# EAGLE design TX5823_ZMR250_V (EAGLE 7.7.0)
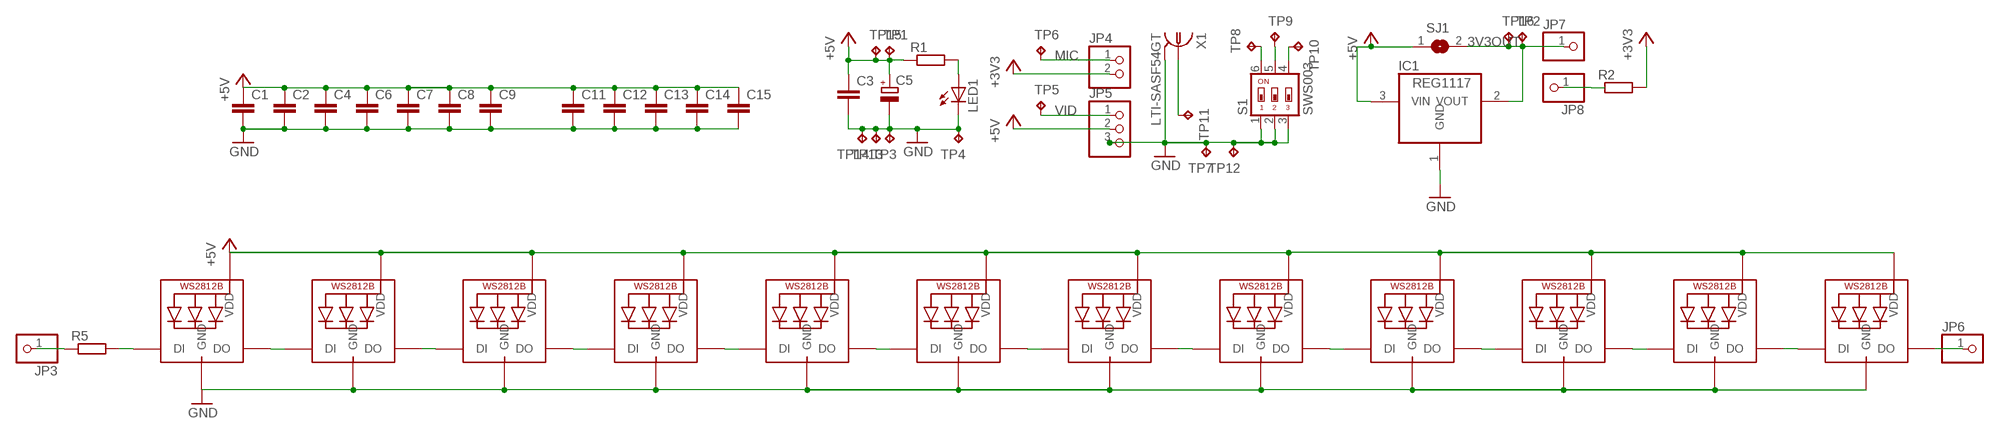
[diagram p0: schematic, sheet 1]

## Parts
C1  C-EUC0603  [C0603]
C2  C-EUC0603  [C0603]
C3  C-EUC0805  [C0805]
C4  C-EUC0603  [C0603]
C5  CPOL-EUSMCB  [SMC_B]
C6  C-EUC0603  [C0603]
C7  C-EUC0603  [C0603]
C8  C-EUC0603  [C0603]
C9  C-EUC0805  [C0805]
C11  C-EUC0603  [C0603]
C12  C-EUC0603  [C0603]
C13  C-EUC0805  [C0805]
C14  C-EUC0805  [C0805]
C15  C-EUC0805  [C0805]
IC1  REG1117  [SOT223]
JP3  PINHD-1X1  [1X01]
JP4  PINHD-1X2  [1X02]
JP5  PINHD-1X3  [1X03]
JP6  PINHD-1X1  [1X01]
JP7  PINHD-1X1  [1X01]
JP8  PINHD-1X1  [1X01]
LED1  LEDCHIPLED_0603  [CHIPLED_0603]
LED2  WS2812B5050  [WS2812B]
LED3  WS2812B5050  [WS2812B]
LED4  WS2812B5050  [WS2812B]
LED5  WS2812B5050  [WS2812B]
LED6  WS2812B5050  [WS2812B]
LED7  WS2812B5050  [WS2812B]
LED8  WS2812B5050  [WS2812B]
LED9  WS2812B5050  [WS2812B]
LED10  WS2812B5050  [WS2812B]
LED11  WS2812B5050  [WS2812B]
LED12  WS2812B5050  [WS2812B]
LED13  WS2812B5050  [WS2812B]
R1  R-EU_R0603  [R0603]
R2  R-EU_M1406  [M1406]
R5  R-EU_R0603  [R0603]
S1  SWS003  [SMS-003]
SJ1  SJ  [SJ]
TP1  TPB1,27  [B1,27]
TP2  TPB1,27  [B1,27]
TP3  TPB1,27  [B1,27]
TP4  TPB1,27  [B1,27]
TP5  TPB1,27  [B1,27]
TP6  TPB1,27  [B1,27]
TP7  TPB1,27  [B1,27]
TP8  TPB1,27  [B1,27]
TP9  TPB1,27  [B1,27]
TP10  TPB1,27  [B1,27]
TP11  TPB1,27  [B1,27]
TP12  TPB1,27  [B1,27]
TP13  TPB1,27  [B1,27]
TP14  TPB1,27  [B1,27]
TP15  TPB1,27  [B1,27]
TP16  TPB1,27  [B1,27]
X1  LTI-SASF54GT  [LTI-SASF54GT]

## Nets
3V3OUT: IC1.2(VOUT) JP7.1 SJ1.2 TP2.TP TP16.TP
+3V3: JP4.2 R2.2
+5V: C1.1 C2.1 C3.1 C4.1 C5.+ C6.1 C7.1 C8.1 C9.1 C11.1 C12.1 C13.1 C14.1 C15.1 IC1.3(VIN) JP5.2 LED2.1-VDD(VDD) LED3.1-VDD(VDD) LED4.1-VDD(VDD) LED5.1-VDD(VDD) LED6.1-VDD(VDD) LED7.1-VDD(VDD) LED8.1-VDD(VDD) LED9.1-VDD(VDD) LED10.1-VDD(VDD) LED11.1-VDD(VDD) LED12.1-VDD(VDD) LED13.1-VDD(VDD) R1.1 SJ1.1 TP1.TP TP15.TP
GND: C1.2 C2.2 C3.2 C4.2 C5.- C6.2 C7.2 C8.2 C9.2 C11.2 C12.2 C13.2 C14.2 C15.2 IC1.1(GND) JP5.3 LED1.C LED2.3-GND(GND) LED3.3-GND(GND) LED4.3-GND(GND) LED5.3-GND(GND) LED6.3-GND(GND) LED7.3-GND(GND) LED8.3-GND(GND) LED9.3-GND(GND) LED10.3-GND(GND) LED11.3-GND(GND) LED12.3-GND(GND) LED13.3-GND(GND) S1.1 S1.2 S1.3 TP3.TP TP4.TP TP7.TP TP12.TP TP13.TP TP14.TP X1.2 X1.3 X1.4 X1.5
IN: LED2.4-DIN(DI) R5.2
IO1: LED2.2-DOUT(DO) LED3.4-DIN(DI)
IO3: LED4.2-DOUT(DO) LED5.4-DIN(DI)
LED_IN: JP3.1 R5.1
MIC: JP4.1 TP6.TP
N$1: S1.6 TP8.TP
N$2: S1.5 TP9.TP
N$3: S1.4 TP10.TP
N$4: JP8.1 R2.1
N$5: LED5.2-DOUT(DO) LED6.4-DIN(DI)
N$6: TP11.TP X1.1
N$8: LED8.4-DIN(DI) LED10.2-DOUT(DO)
N$9: LED3.2-DOUT(DO) LED4.4-DIN(DI)
N$10: LED1.A R1.2
N$11: LED6.2-DOUT(DO) LED7.4-DIN(DI)
N$12: LED8.2-DOUT(DO) LED11.4-DIN(DI)
N$13: LED7.2-DOUT(DO) LED9.4-DIN(DI)
N$14: LED9.2-DOUT(DO) LED10.4-DIN(DI)
N$16: LED11.2-DOUT(DO) LED12.4-DIN(DI)
N$17: LED12.2-DOUT(DO) LED13.4-DIN(DI)
N$18: JP6.1 LED13.2-DOUT(DO)
VID: JP5.1 TP5.TP

## Library data of the parts
C1-C4 C6-C9 C11-C15 = rcl:C-EU: CAPACITOR, European symbol
C5 = rcl:CPOL-EU: POLARIZED CAPACITOR, European symbol
IC1 = burr-brown:REG1117: 800mA and 1A Low Dropout (LDO) Positive Regulator 1.8V, 2.5V, 2.85V, 3.3V, 5V, and Adj; MPN: REG1117; OC_FARNELL: 1097566; OC_NEWARK: 14P6981
JP3 JP6-JP8 = adafruit:PINHD-1X1: Pin header 1x1 for 0.1" spacing With round pins
JP4 = pinhead:PINHD-1X2: PIN HEADER
JP5 = pinhead:PINHD-1X3: PIN HEADER
LED1 = led:LED: LED OSRAM: - CHIPLED LG R971, LG N971, LY N971, LG Q971, LY Q971, LO R971, LY R971 LH N974, LH R974 LS Q976, LO Q976, LY Q976 LO Q996 - Hyper CHIPLED LW Q18S LB Q993, LB Q99A, LB R99A - SideLED LS A670, LO A670, LY A670, LG A670, LP A670 LB A673, LV A673, LT A673, LW A673 LH A674 LY A675 LS A676, LA A676, LO A676, LY A676, LW A676 LS A679, LY A679, LG A679 - Hyper Micro SIDELED® LS Y876, LA Y876, LO Y876, LY Y876 LT Y87S - SmartLED LW L88C, LW L88S LB L89C, LB L89S, LG L890 LS L89K, LO L89K, LY L89K LS L896, LA L896, LO L896, LY L896 - TOPLED LS T670, LO T670, LY T670, LG T670, LP T670 LSG T670, LSP T670, LSY T670, LOP T670, LYG T670 LG T671, LOG T671, LSG T671 LB T673, LV T673, LT T673, LW T673 LH T674 LS T676, LA T676, LO T676, LY T676, LB T676, LH T676, LSB T676, LW T676 LB T67C, LV T67C, LT T67C, LS T67K, LO T67K, LY T67K, LW E67C LS E67B, LA E67B, LO E67B, LY E67B, LB E67C, LV E67C, LT E67C LW T67C LS T679, LY T679, LG T679 LS T770, LO T770, LY T770, LG T770, LP T770 LB T773, LV T773, LT T773, LW T773 LH T774 LS E675, LA E675, LY E675, LS T675 LS T776, LA T776, LO T776, LY T776, LB T776 LHGB T686 LT T68C, LB T68C - Hyper Mini TOPLED® LB M676 - Mini TOPLED Santana® LG M470 LS M47K, LO M47K, LY M47K Source: http://www.osram.convergy.de LUXEON: - LUMILED® LXK2-PW12-R00, LXK2-PW12-S00, LXK2-PW14-U00, LXK2-PW14-V00 LXK2-PM12-R00, LXK2-PM12-S00, LXK2-PM14-U00 LXK2-PE12-Q00, LXK2-PE12-R00, LXK2-PE12-S00, LXK2-PE14-T00, LXK2-PE14-U00 LXK2-PB12-K00, LXK2-PB12-L00, LXK2-PB12-M00, LXK2-PB14-N00, LXK2-PB14-P00, LXK2-PB14-Q00 LXK2-PR12-L00, LXK2-PR12-M00, LXK2-PR14-Q00, LXK2-PR14-R00 LXK2-PD12-Q00, LXK2-PD12-R00, LXK2-PD12-S00 LXK2-PH12-R00, LXK2-PH12-S00 LXK2-PL12-P00, LXK2-PL12-Q00, LXK2-PL12-R00 Source: www.luxeon.com KINGBRIGHT: KA-3528ASYC Source: www.kingbright.com
LED2-LED13 = adafruit:WS2812B
R1 R5 = resistor:R-EU_: RESISTOR, European symbol
R2 = rcl:R-EU_: RESISTOR, European symbol
S1 = smd-special:SWS003: SMD Dip Switch 3 pol.
SJ1 = jumper:SJ: SMD solder JUMPER
TP1-TP16 = testpad:TP: Test pad
X1 = con-coax:LTI-SASF54GT: SMA vertical PCB thrue hole jack Source: Lighthorse Technologies, inc. SASF54GT.pdf; OC_FARNELL: unknown; OC_NEWARK: unknown

## Board
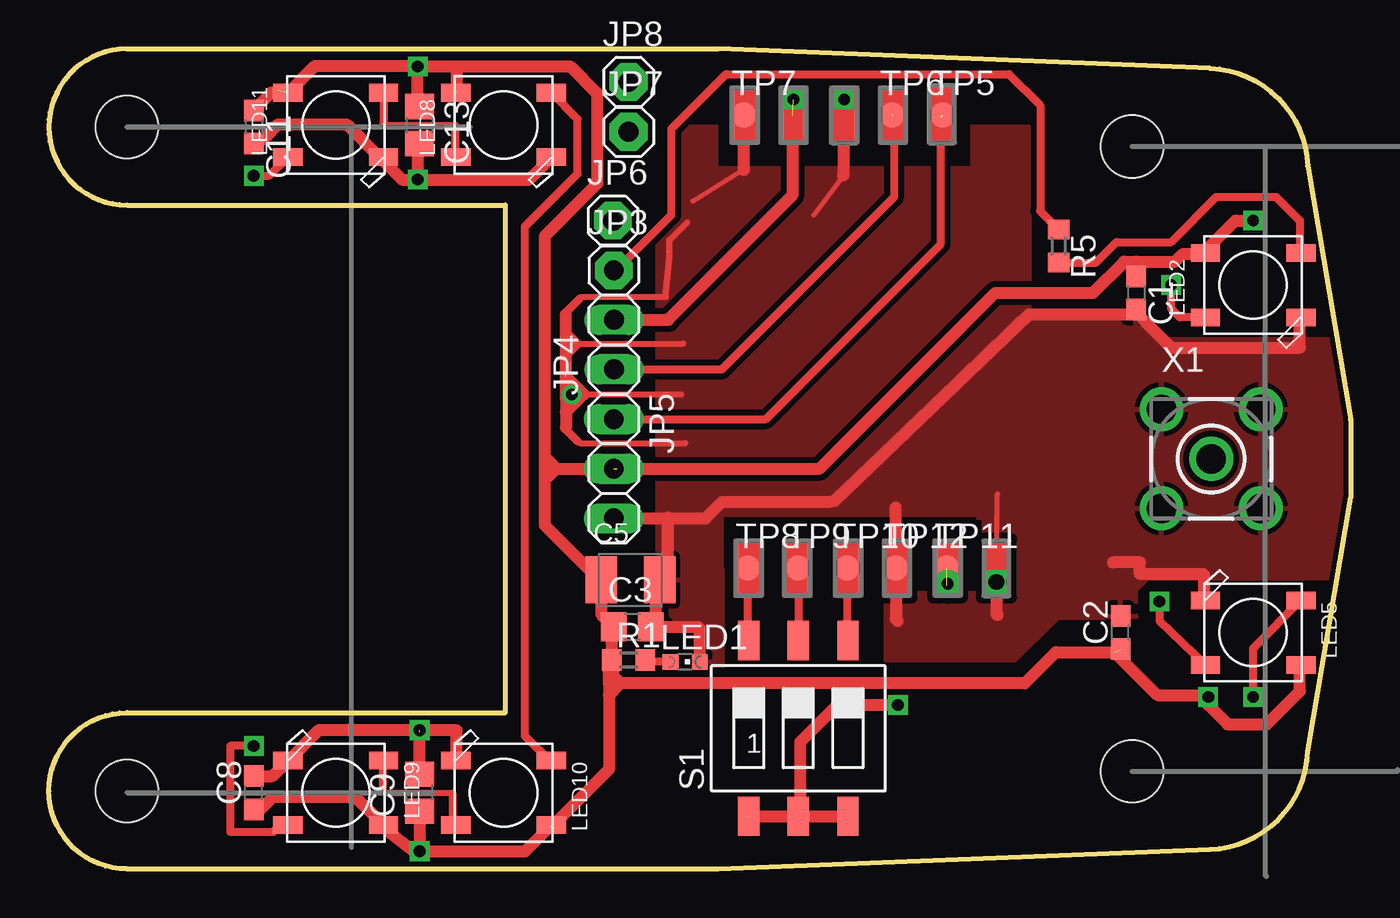
[diagram p1: board, top side]
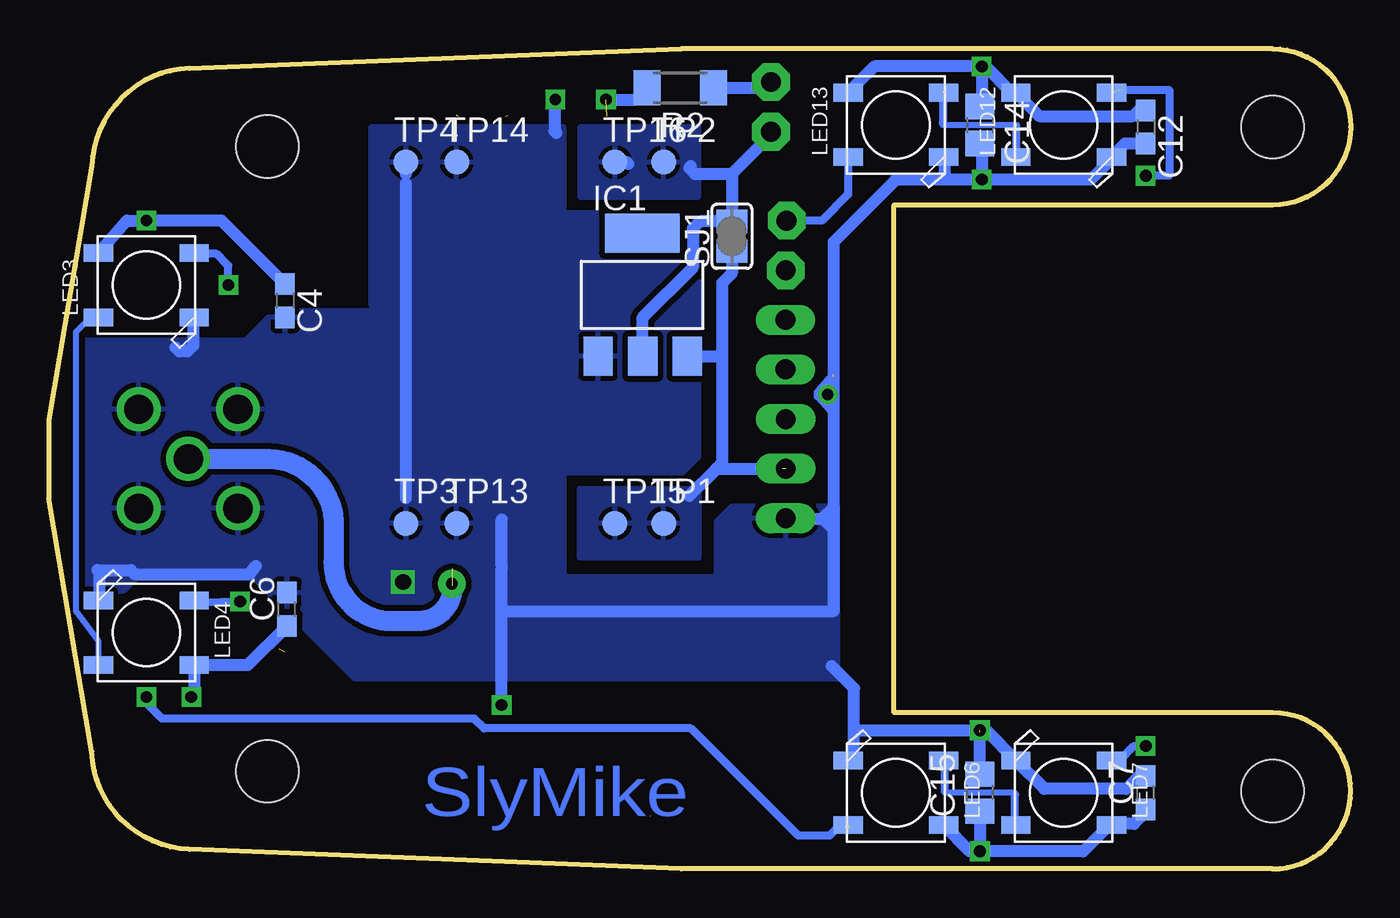
[diagram p2: board, bottom side, seen from below]

Size 66.7 x 42 mm. Coordinates in mm from the lower left corner, seen from the top.
Outline: 4,0 34.3,0 59.5,1 arc85 64.5,6 66.7,19 66.7,23 64.5,36 arc85 59.5,41 34.3,42 4,42 arc90 0,38 arc90 4,34 23.4,34 23.4,8 4,8 arc90 0,4 arc90 4,0
Copper layers (1*16): Top 0.035mm / dielectric 1.5mm / Bottom 0.035mm
Design rules "default *": minimum track width 10mil, minimum drill 24mil, track to track 12mil, track to pad 12mil, pad to pad 12mil, via to via 12mil, smd to smd 12mil, copper to edge 10mil, drill to drill 12mil, minimum pad ring 10mil, minimum via ring 8mil, stop-mask expansion 4mil, vias tented up to drill 0mil, thermal gap 10mil
Holes 3.2 mm at 4,38 4,4 55.5,37 55.5,5
tRestrict: area 34.3,36 to 47.2,38.6; area 34.6,15.4 to 47.5,18

### Footprints (pad centres in the part's own frame; a part is rotated, then mirrored left to right if it is on the bottom)
C0603 = smd 1.1 x 1: 1 -0.85,0; 2 0.85,0
C0805 = smd 1.3 x 1.5: 1 -0.95,0; 2 0.95,0
SMC_B = smd 1.6 x 2.4: + -1.5,0; - 1.5,0
SOT223 = smd 1.499 x 2.007: 1 -2.261,-3.15; 2 0.025,-3.15; 3 2.311,-3.15 | smd 3.81 x 2.007: 4 0,3.15
1X01 = drill 1.016 pad 1.93 octagon: 1 0,0
1X02 = drill 1.016 long: 1 -1.27,0; 2 1.27,0
1X03 = drill 1.016 long: 1 -2.54,0; 2 0,0; 3 2.54,0
CHIPLED_0603 = smd 0.8 x 0.8: A 0,-0.75; C 0,0.75
WS2812B = smd 1.5 x 0.9: 1-VDD 2.45,-1.65; 2-DOUT 2.45,1.65; 3-GND -2.45,1.65; 4-DIN -2.45,-1.65
R0603 = smd 1 x 1.1: 1 -0.85,0; 2 0.85,0
M1406 = smd 1.4 x 1.8: 1 -1.7,0; 2 1.7,0
SMS-003 = smd 1.092 x 2.007: 1 -2.54,-4.496; 2 0,-4.496; 3 2.54,-4.496; 4 2.54,4.496; 5 0,4.496; 6 -2.54,4.496
SJ = smd 1.168 x 1.6: 1 -0.762,0; 2 0.762,0
B1,27 = smd 1.27 x 1.27: TP 0,0
LTI-SASF54GT = drill 1.5 pad 2.2: 1 0,0; 2 -2.54,2.54; 3 2.54,2.54; 4 2.54,-2.54; 5 -2.54,-2.54

### Placement (x,y rotation side)
C1  55.7,29.5 270 top
C2  54.9,12.1 90 top
C3  29.9,12.4 0 top
C4  54.6,29.1 270 bottom
C5  29.8,14.8 0 top
C6  54.5,13.3 90 bottom
C7  10.5,3.9 90 bottom
C8  10.5,3.9 90 top
C9  19,3.9 90 top
C11  10.5,38 270 top
C12  10.5,38 270 bottom
C13  19,38.1 270 top
C14  19,38.1 270 bottom
C15  19,3.9 90 bottom
IC1  36.3,29.4 0 bottom
JP3  28.94,30.65 0 top
JP4  28.95,26.85 90 top
JP5  28.94,20.49 270 top
JP6  28.9,33.2 0 top
JP7  29.7,37.75 0 top
JP8  29.7,40.3 0 top
LED1  32.6,10.6 270 top
LED2  61.7,29.9 180 top
LED3  61.7,29.9 180 bottom
LED4  61.7,12.1 0 bottom
LED5  61.7,12.1 0 top
LED6  23.3,3.9 0 bottom
LED7  14.7,3.9 0 bottom
LED8  23.3,38.1 180 top
LED9  14.7,3.9 0 top
LED10  23.3,3.9 0 top
LED11  14.7,38.1 180 top
LED12  14.7,38.1 180 bottom
LED13  23.3,38.1 180 bottom
R1  29.7,10.7 0 top
R2  34.35,40 180 bottom
R5  51.73,31.9 270 top
S1  38.4,7.2 0 top
SJ1  31.7,32.4 90 bottom
TP1  35.2,17.7 0 bottom
TP2  35.2,36.2 0 bottom
TP3  48.4,17.7 0 bottom
TP4  48.4,36.2 0 bottom
TP5  45.8,38.6 0 top
TP6  43.2,38.6 0 top
TP7  35.6,38.6 0 top
TP8  35.8,15.4 0 top
TP9  38.4,15.4 0 top
TP10  40.9,15.4 0 top
TP11  46,15.4 0 top
TP12  43.4,15.4 0 top
TP13  45.8,17.7 0 bottom
TP14  45.8,36.2 0 bottom
TP15  37.7,17.7 0 bottom
TP16  37.7,36.2 0 bottom
X1  59.55,21 0 top

### Tracks (layer width: path | path; a pad name or v marks a point on that pad's centre or on a via)
3V3OUT
  Bottom 0.61: 35.25,36.45 35.15,36.05 | 33.8,36 33.9,35.9 33.6,35.6 31.7,35.6 | 31.6,33.26 SJ1.2 | 37.6,36.2 37.1,36.2 37,36.1 | SJ1.2 33.34,33.16 33.7,32.8 33.7,30.8 36.3,28.2 36.3,26.28 IC1.2 | 31.7,35.6 SJ1.2 | JP7.1 29.7,37.6 31.7,35.6
  pour Bottom: 33.4,38 39.5,38 39.5,34.4 33.4,34.4
+3V3  (via drill 0.6)  (1 unrouted)
  Top 0.61: 38.1,38.54 38.1,34.5 31.72,28.12 JP4.2
  Bottom 0.61: 36.35,39.7 R2.2 36.65,39.4 v38.15,39.4
+5V  (via drill 0.6)  (8 unrouted)
  Top 0.406: LED8.1-VDD 20.65,39.75
  Top 0.61: 55.7,31.1 55.1,31.1 53.5,29.5 48.5,29.5 39.49,20.49 JP5.2 27.69,20.49 | 55.7,31.1 57.7,31.1 58.1,31.5 59.2,31.5 LED2.1-VDD 59.3,31.5 59.3,31.7 60.8,33.2 v61.7,33.2 | 59.2,8.9 v59.4,8.8 59.4,8.4 60.4,7.4 62.4,7.4 64.1,9.1 64.1,10.4 LED5.1-VDD 64.3,10.3 64.1,10.3 | 59.2,8.9 56.8,8.9 54.6,11.1 51.6,11.1 50,9.5 29.3,9.5 | 59.2,8.9 59.25,8.95 | 29.3,9.5 28.7,9.5 | C1.1 55.7,31.1 | v19,0.9 18.7,0.9 16.95,2.25 LED9.1-VDD 15.7,3.7 11.5,3.7 10.85,3.05 C7.1 | v19,0.9 24.4,0.9 LED10.1-VDD 25.8,2.3 | 18.9,41.1 13.6,41.1 LED11.1-VDD 11.4,39.75 C11.1 | LED8.1-VDD 20.55,39.75 | 18.95,39.1 C14.1 | 18.95,39.1 19.3,39.1 | 18.9,41.1 20.7,41.1 | 20.7,41.1 20.9,40.9 20.9,39.8 20.8,39.7 | 18.95,39.1 18.9,39.1 18.9,41.1 | C15.1 v19,0.9 | 28.7,9.5 28.7,8.9 | 28.7,8.9 28.7,5.1 25.7,2.1 | 28.7,9.5 28.7,10.1 | 28.7,10.1 28.7,10.75 R1.1 28.85,12.3 C3.1 28.3,13.05 C5.+ 27.8,15.3 27.7,15.3 25.4,17.6 25.4,19.9 | 20.7,41.1 26.7,41.1 28.1,39.7 28.1,35.1 25.4,32.4 25.4,21.1 | 25.4,21.1 25.4,20.5 | 25.4,20.5 25.9,20.5 | 25.9,20.5 26,20.5 | 26,20.5 29.1,20.5 | 25.4,20.5 25.4,19.9 | 28.7,8.9 29.3,9.5 | 29.3,9.5 28.9,9.9 | 28.9,9.9 28.7,10.1 | 28.7,10.1 28.9,10.3 28.9,9.9 | 25.9,20.5 25.9,20.6 | 25.9,20.6 25.4,21.1 | 25.9,20.6 26,20.5 | 26,20.5 25.4,19.9
  Bottom 0.406: LED7.1-VDD 12.35,2.25
  Bottom 0.61: LED4.1-VDD 59.25,8.95 v59.4,8.8 | 64.1,31.5 LED3.1-VDD 62.7,33.2 v61.7,33.2 57.85,33.2 C4.1 | 59.2,10.5 LED4.1-VDD | 12.35,2.25 13.7,0.9 v19,0.9 | v19,0.9 19.5,0.9 LED6.1-VDD 21.25,2.25 | C7.1 10.5,2.9 11.1,2.3 12.2,2.3 LED7.1-VDD | 18.9,41.1 18.7,41.1 17.35,39.75 LED12.1-VDD 15.95,38.55 11.15,38.55 10.8,38.9 10.55,38.9 C11.1 10.5,38.9 | 18.9,41.1 24.4,41.1 LED13.1-VDD | 18.9,41.1 18.9,39.1 | 33.9,19.1 32.5,20.5 | 32.5,20.5 29.51,20.5 29.5,20.49 JP5.2 | 19,3.1 v19,0.9 | 31.7,31.6 32,31.6 32.2,31.4 | 32.5,20.5 32.2,20.8 32.2,26.4 | SJ1.1 31.7,30.5 32.2,30 32.2,26.4 | IC1.3 32.25,26.25 32.2,26.3 32.25,26.45 32.2,26.4 | LED4.1-VDD 56.5,10.45 C6.1
  pour Bottom: 33.4,15.9 39.5,15.9 39.5,19.5 33.4,19.5
GND  (via drill 0.6, 0.8)  (7 unrouted)
  Top 0.254: 40.7,35.5 39.2,33.5 | 35.6,35.8 33,34.2 | v48.55,14.7 48.6,19.2
  Top 0.305: v26.8,24.3 26.9,24.3 | 27.4,24.3 32.4,24.3 | 27.1,21.9 27.2,21.8 32.6,21.8 | 27.2,29.2 27.3,29.3 31.6,29.3 31.8,31.3 31.8,32.2 32.7,33.1 | 26.5,26.8 26.6,26.9 27.2,26.9 | 27.2,26.9 32.5,26.9 | 27.2,26.9 26.7,26.4 26.7,27.4 27.2,26.9
  Top 0.406: 35.9,2.7 S1.2 S1.3 38.7,2.7 38.5,2.9 | 26.5,22.6 26.5,22.5 27.1,21.9 | 26.5,28.4 26.5,28.5 27.2,29.2
  Top 0.61: 35.7,2.9 35.9,2.7 | 56.1,28.1 57.5,26.7 64.1,26.7 64.1,28.2 LED2.3-GND | 59.1,13.7 arc90 59.2,13.8 59.2,15 arc90 59.1,15.1 55.9,15.1 55.9,15.7 54.52,15.7 | 18.9,7.1 13.8,7.1 LED9.3-GND | 20.45,5.55 LED10.3-GND | LED10.3-GND 20.9,5.5 | LED10.3-GND 20.8,5.5 | LED10.3-GND 20.9,5.6 20.9,7.1 v19,7.1 | 16.95,36.45 18.1,35.3 v18.9,35.3 | v18.9,35.3 24.6,35.3 LED8.3-GND 25.65,36.45 | C14.2 19,37 18.9,36.9 v18.9,35.3 | LED11.3-GND 16.95,36.45 | 16.95,36.45 15.3,38.1 11.7,38.1 11.1,37.5 10.75,37.2 C11.2 | C15.2 v19,7.1 | v19,7.1 18.9,7 18.9,7.1 | 18.9,7.1 v19,7.1 | LED1.C 33.35,12.3 33.25,12.4 C3.2 31,12.4 31.1,12.5 31.1,14.6 C5.- 31.7,15.1 31.7,18 | JP5.3 33.65,17.95 34.5,18.8 40,18.8 40.25,18.85 50.2,28.4 55.85,28.4 C1.2 | 38.5,2.9 38.5,6.5 40.4,8.4 v43.5,8.4 | 35.9,2.5 35.9,2.7 | 35.9,2.7 40.9,2.7 | 40.7,38.7 40.7,35.5 | TP7.TP 35.6,35.8 | 12.2,5.5 11.45,4.75 C7.2 | v26.8,24.3 26.5,24.1 26.5,23.4 | 26.5,23.4 26.5,22.6 | 26.7,24.2 26.8,24.2 26.9,24.3 27.4,24.3 | 26.5,24.2 26.5,25.2 | 26.5,25.2 26.5,26.8 26.5,28.4 | 43.5,12.7 43.4,12.8 TP12.TP 43.4,18.5 | 27.4,24.3 26.5,25.2 | 27.4,24.3 26.5,23.4 | v48.55,14.7 48.55,13.05 48.6,13
  Bottom 0.406: 25.7,5.5 LED6.3-GND 25.45,5.55 | 26.4,23.2 27.3,24.2 27.3,24.4 26.5,25.3 26.6,25.3
  Bottom 0.61: LED4.3-GND 63.75,13.65 64.1,13.7 64.1,15.2 64.2,15.3 62.5,15.3 62.3,15.1 56.4,15.1 56.1,15.5 | LED3.3-GND 59.3,28.3 59.3,26.8 59.6,26.5 60,26.5 60.2,26.7 | C7.2 10.85,4.75 11.5,4.1 15.7,4.1 LED7.3-GND 18.7,7.1 v19,7.1 25.4,7.1 25.45,7.05 | v18.9,35.3 13.3,35.3 12.15,36.45 LED12.3-GND 11.55,37.15 C11.2 | v18.9,35.3 20.6,35.3 20.8,35.5 20.8,36.3 20.7,36.4 LED13.3-GND | 18.9,37.3 v18.9,35.3 | 26.5,17.9 27,17.9 | 48.5,17.9 48.7,17.9 | 43.5,15.5 43.5,17.9 | v18.9,35.3 23.3,35.3 26.5,32.1 26.5,25.3 26.5,18.5 | 26.5,18.5 26.5,17.9 | 26.5,17.9 26.5,17.4 | 26.5,17.4 26.5,13.2 43.5,13.2 | 43.6,8.2 v43.5,8.4 43.5,13.2 | 43.5,13.2 43.5,15.4 | 26.5,17.4 27,17.9 | 27,17.9 27,18 26.5,18.5 | 27,17.9 28.89,17.9 JP5.3 | TP4.TP 48.4,35.6 | 48.4,19 48.4,35.1 | 19,5 19,7 | v40.75,39.4 40.8,39.5 40.8,37.8 40.7,37.7 | 25.45,5.55 25.45,7.05 | 25.45,7.05 25.45,9.25 26.6,10.4
  pour Top: 42.9,10.7 49.5,10.7 51.7,12.9 55.7,12.9 55.7,14.3 56.3,14.9 56.3,17.7 49.3,17.7 arc90 48.1,16.5 48.3,14.1 43.5,14.1 42.9,14.7
  pour Top: 31.3,38 50.2,38 50.2,27.6 50.2,18 34.5,18 34.5,10.4 33.3,10.4 33.3,12.4 33.4,12.5 32.4,12.5 31.1,13.8 31.1,15.9 31.2,16 31.2,37.9
  pour Top: 46.6,28.4 46.6,18 47.9,18 47.9,16.7 50.2,16.7 50.2,14.9 67.4,14.9 67.6,27.1 57.2,27.1 55.9,28.4
  pour Bottom: 40.3,15.9 40.3,20.3 34.2,20.3 33.4,21.1 33.4,33.6 40.3,33.6 40.3,38 50.2,38 50.2,28.9 49.5,28.2 49.5,15.9
  pour Bottom: 40.3,15.9 40.3,15 32.5,15 32.5,17.8 31.7,18.6 26.3,18.6 26.3,9.7 51,9.7 56.2,14.9 62.2,14.9 62.9,14.2 67.3,14.2 67.3,26.9 67.5,27.1 56.6,27.1 55.1,28.6 47.8,28.6 47.7,15.9
IN
  Top 0.406: R5.2 53.65,31.05 54.7,32.1 57.5,32.1 59.8,34.4 62.9,34.4 64.1,33.2 64.1,31.6 LED2.4-DIN
IO1  (via drill 0.6)
  Top 0.406: LED2.2-DOUT 57.95,28.25 57.5,28.7 v57.5,29.9
  Bottom 0.406: v57.5,29.9 57.5,30.9 58.1,31.5 59.2,31.5 LED3.4-DIN
IO3  (via drill 0.6)
  Top 0.406: 59.7,10.5 59.4,10.5 LED5.4-DIN 56.9,12.7 v56.9,13.7
  Bottom 0.406: LED4.2-DOUT 58.95,13.65 v56.9,13.7
LED_IN
  Top 0.406: JP3.1 29.2,30.65 29.2,30.8 31.9,33.5 31.9,37.9 34.7,40.7 49.2,40.7 50.8,39.1 50.8,33.68 R5.1
MIC  (1 unrouted)
  Top 0.406: 43.3,38.54 43.3,34.4 34.48,25.58 JP4.1
N$1
  Top 0.406: S1.6 arc90 S1.6 35.8,11.76 TP8.TP
N$2
  Top 0.406: S1.5 arc90 S1.5 TP9.TP
N$3
  Top 0.406: S1.4 arc90 S1.4 40.9,11.74 TP10.TP
N$4
  Bottom 0.61: R2.1 30,40 JP8.1
N$5  (via drill 0.6)  (1 unrouted)
  Top 0.406: 63.75,13.95 LED5.2-DOUT 61.7,11.3 v61.7,8.8
  Bottom 0.406: LED6.4-DIN 25.55,2.15 | 25.9,2.1 26.3,2.1 26.7,1.7 28.3,1.7 33.8,7.2 44.4,7.2 44.9,7.7 60.9,7.7 61.6,8.4 v61.7,8.8
N$6  (1 unrouted)
  Bottom 1.016: X1.1 55.7,21 arc90 52.1,17.8 52.1,16 arc-90 49.4,12.7 47.7,12.7 arc-90 46,14.5
N$8
  Top 0.406: LED8.4-DIN 27.1,38.4 27.1,35.6 24.4,32.9 24.4,6.8 25.75,5.45 LED10.2-DOUT
N$9
  Bottom 0.305: LED4.4-DIN 64.15,11.65 65.3,13.2 65.3,27.5 64.7,28.1 64.3,28.1 LED3.2-DOUT
N$10
  Top 0.406: LED1.A 30.45,10.6 R1.2
N$11
  Bottom 0.3: 17.2,3.8 17.3,3.9 20.8,3.9 20.8,4
  Bottom 0.406: 20.45,5.55 LED6.2-DOUT 20.8,5.3 20.8,4 | LED7.4-DIN 17.25,2.25 | 17.55,2.25 17.25,2.25 | 17.25,2.25 17.2,2.3 17.2,3.8
N$12  (1 unrouted)
  Top 0.3: 17.1,38.1 18.1,38.1 20.8,38.1
  Top 0.305: 20.8,38.1 20.85,38.05
  Top 0.406: LED11.4-DIN 17.55,39.75 17.3,39.7 17.15,39.55 17.15,38.15 | LED8.2-DOUT 20.85,38.05
N$13  (via drill 0.6)
  Top 0.406: 10.3,6.2 v10.5,6.3 9.3,6.3 9.3,1.9 11.5,1.9 11.9,2.3 12.2,2.3 LED9.4-DIN
  Bottom 0.406: LED7.2-DOUT 11.85,5.55 11.1,6.3 v10.5,6.3
N$14
  Top 0.3: 17.1,4 17.1,3.9 20.7,3.9 20.7,3.8
  Top 0.406: LED9.2-DOUT 17.35,5.55 | 17.55,5.55 17.35,5.55 | 17.35,5.55 17.1,5.3 17.1,4 | 20.7,3.8 20.7,2.4 LED10.4-DIN
N$15  (via drill 0.6 pad 1.42)
  other vias: 46.05,14.6
N$16  (via drill 0.6)  (1 unrouted)
  Top 0.406: 11.85,36.45 LED11.2-DOUT 11.3,35.5 v10.5,35.5
  Bottom 0.406: 12.3,39.7 LED12.4-DIN | 11.7,39.9 9.3,39.9 9.3,35.5 v10.5,35.5
N$17  (1 unrouted)
  Bottom 0.3: 20.9,38.1 17.1,38.1
  Bottom 0.305: 20.9,38.2 20.9,38.1
  Bottom 0.406: LED13.4-DIN 20.45,39.75 20.9,39.7 20.9,38.2 | 17.15,38.05 LED12.2-DOUT
N$18
  Bottom 0.406: 28.9,33.3 JP6.1 27.1,33.2 25.75,34.55 LED13.2-DOUT
N$20  (via drill 0.6)
  other vias: 18.9,41.1
VID  (1 unrouted)
  Top 0.406: JP5.1 36.73,23.03 45.7,32 45.7,38.52
(copper drawn outside any net)
  shapes: Top area x11

### Text on the board
Bottom: SlyMike